# EAGLE design test_reg (EAGLE 9.6.2)
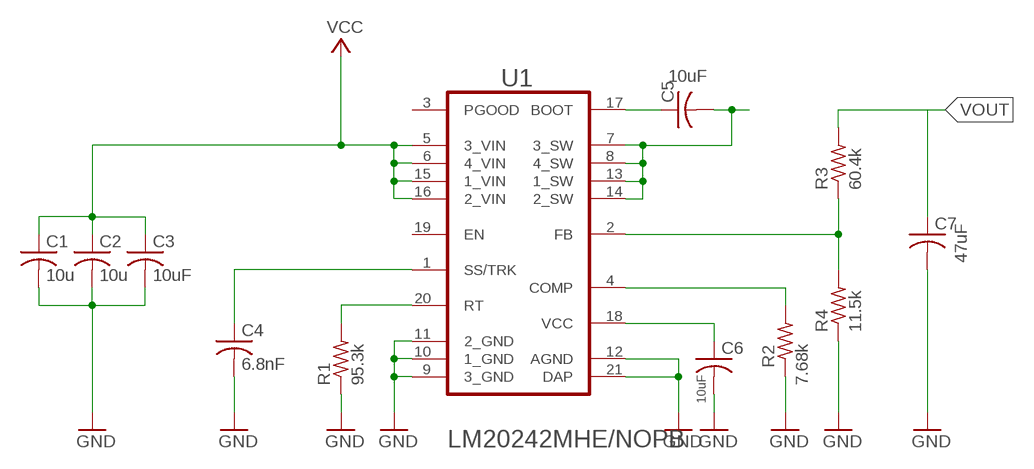
[diagram p0: schematic, sheet 1]

## Parts
C1  10u  C-USC0805  [C0805]
C2  10u  C-USC0805  [C0805]
C3  10uF  C-USC0805  [C0805]
C4  6.8nF  C-USC0805  [C0805]
C5  10uF  C-USC0805  [C0805]
C6  10uF  C-USC0805  [C0805]
C7  47uF  C-USC0805  [C0805]
R1  95.3k  R-US_R0805  [R0805]
R2  7.68k  R-US_R0805  [R0805]
R3  60.4k  R-US_R0805  [R0805]
R4  11.5k  R-US_R0805  [R0805]
U1  TI_NATIONAL_SEMICONDUCTOR_LM20242MHE-NOPBTI_NATIONAL_SEMICONDUCTOR_LM20242MHE-NOPB_0_0  [TI_NATIONAL_SEMICONDUCTOR_LM20242MHE-NOPB_0]

## Nets
GND: C1.2 C2.2 C3.2 C4.2 C6.2 C7.2 R1.1 R2.1 R4.1 U1.9(3_GND) U1.10(1_GND) U1.11(2_GND) U1.12(AGND) U1.21(DAP)
N$1: R1.2 U1.20(RT)
N$2: R2.2 U1.4(COMP)
N$3: C4.1 U1.1(SS/TRK)
N$4: C5.2 U1.7(3_SW) U1.8(4_SW) U1.13(1_SW) U1.14(2_SW)
N$5: C5.1 U1.17(BOOT)
N$6: R3.1 R4.2 U1.2(FB)
N$9: C6.1 U1.18(VCC)
VCC: C1.1 C2.1 C3.1 U1.5(3_VIN) U1.6(4_VIN) U1.15(1_VIN) U1.16(2_VIN)
VOUT: C7.1 R3.2
Unconnected: U1.3(PGOOD) U1.19(EN)

## Library data of the parts
C1-C7 = resistor:C-US: CAPACITOR, American symbol
R1-R4 = rcl:R-US_: RESISTOR, American symbol; SPICEPREFIX: R
U1 = NOPB:TI_NATIONAL_SEMICONDUCTOR_LM20242MHE-NOPB: PM-REG-LM20242; CIIVA_IDS: 1490726; CODE__JEDEC: MO-153-ACT; COMPONENT_LINK_1_DESCRIPTION: Datasheet URL; COMPONENT_LINK_1_URL: http://www.ti.com/general/docs/lit/getliterature.tsp?genericPartNumber=LM20242&fileType=pdf; COMP_TYPE: Switcher; FOOTPRINT_VARIANT_NAME_0: Level C; FOOTPRINT_VARIANT_NAME_1: Level B; FOOTPRINT_VARIANT_NAME_2: Level A; IMPORTED: yes; IMPORTED_FROM: vault; IMPORT_TS: 1521854401; MF: TI National Semiconductor; MPN: LM20242MHE/NOPB; PACKAGE: PWP0020A; PACKAGE_DESCRIPTION: Molded TSSOP, Jedec, 6.5 x 4.4 x 0.9mm Body, 20 Lead, 0.65mm Pitch, Exposed Pad; PACKAGE_TOP_MARKING: NSUZXYTT*20242*MH; PIN_COUNT: 20; POWER_WISE: Y; PREFIX: U; RELEASE_DATE: 1464081014; ROHS: Yes; VAULT_GUID: 3837F751-FFDA-45D0-A972-9457BC8C977B; VAULT_REVISION: DB6983F7-91C3-4F88-8B29-BB9202A2DCF1

## Board
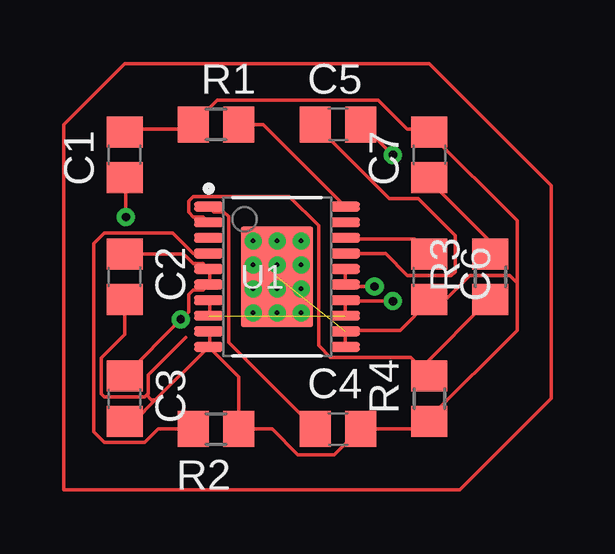
[diagram p1: board, top side]
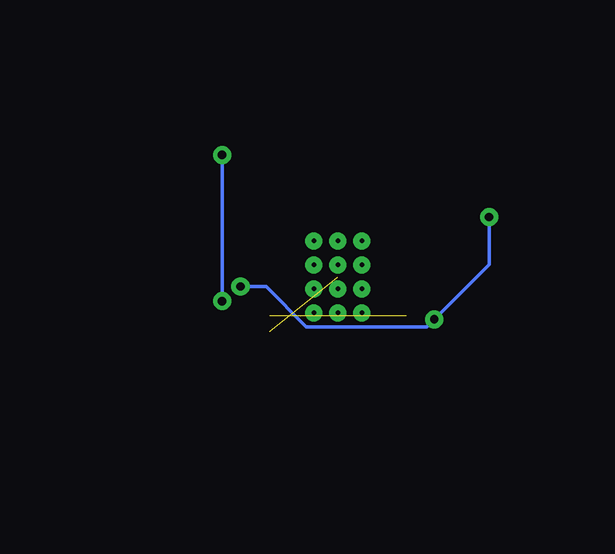
[diagram p2: board, bottom side, seen from below]

No outline drawn. Coordinates in mm, seen from the top.
Copper layers (1*16): Top 0.035mm / dielectric 1.5mm / Bottom 0.035mm
Design rules "default": minimum track width 6mil, minimum drill 0.35mm, track to track 6mil, track to pad 6mil, pad to pad 6mil, via to via 6mil, smd to smd 6mil, copper to edge 40mil, drill to drill 6mil, minimum pad ring 10mil, minimum via ring 8mil, stop-mask expansion 4mil, vias tented up to drill 0mil, thermal gap 10mil

### Footprints (pad centres in the part's own frame; a part is rotated, then mirrored left to right if it is on the bottom)
C0805 = smd 1.3 x 1.5: 1 -0.95,0; 2 0.95,0
R0805 = smd 1.3 x 1.5: 1 -0.95,0; 2 0.95,0
TI_NATIONAL_SEMICONDUCTOR_LM20242MHE-NOPB_0 = smd 1.2 x 0.4: 1 -2.85,2.925; 2 -2.85,2.275; 3 -2.85,1.625; 4 -2.85,0.975; 5 -2.85,0.325; 6 -2.85,-0.325; 7 -2.85,-0.975; 8 -2.85,-1.625; 9 -2.85,-2.275; 10 -2.85,-2.925; 11 2.85,-2.925; 12 2.85,-2.275; 13 2.85,-1.625; 14 2.85,-0.975; 15 2.85,-0.325; 16 2.85,0.325; 17 2.85,0.975; 18 2.85,1.625; 19 2.85,2.275; 20 2.85,2.925 | smd 3 x 4.2: 21 0,0 | drill 0.2 pad 0.5: PAD_1 0,1.5; PAD_2 1,1.5; PAD_3 -1,1.5; PAD_4 -1,0.5; PAD_5 -1,-0.5; PAD_6 -1,-1.5; PAD_7 1,-1.5; PAD_8 0,-1.5; PAD_9 1,-0.5; PAD_10 0,-0.5; PAD_11 1,0.5; PAD_12 0,0.5

### Placement (x,y rotation side)
C1  10.16,22.86 90 top
C2  10.16,17.78 270 top
C3  10.16,12.7 270 top
C4  19.05,11.43 0 top
C5  19.05,24.13 0 top
C6  22.86,17.78 270 top
C7  22.86,22.86 90 top
R1  13.97,24.13 0 top
R2  13.97,11.43 180 top
R3  25.4,17.78 90 top
R4  22.86,12.7 90 top
U1  16.51,17.78 0 top

### Tracks (layer width: path | path; a pad name or v marks a point on that pad's centre or on a via)
GND  (1 unrouted)
  Top 0.152: 11.08,12.85 11.01,12.77 9.31,12.77 9.18,12.9 9.18,14.39 10.16,15.37 C2.2 | 11.08,12.85 11.14,12.9 11.14,13.68 12.7,15.24 | C3.2 10.55,11.75 11.44,12.64 | 11.44,12.64 U1.10 | U1.10 14.92,13.6 R2.1 16.31,11.43 17.37,10.36 18.9,10.36 19.96,11.43 C4.2 22.55,11.43 22.86,11.73 R4.1 22.86,11.89 26.52,15.54 26.52,17.53 | C1.2 10.21,23.93 12.8,23.93 12.95,24.08 R1.1 13.11,24.23 14.02,25.15 20.73,25.15 21.95,23.93 22.86,23.93 C7.2 22.86,23.77 26.52,20.12 26.52,17.53 | U1.11 19.36,14.94 19.36,15.39 U1.12 19.51,15.54 21.64,15.54 22.86,16.76 C6.2 22.86,16.92 23.62,16.92 24.54,17.83 26.21,17.83 26.52,17.53 | U1.9 13.72,15.39 13.72,14.94 U1.10 | 11.08,12.85 11.28,12.65 11.43,12.65 11.44,12.64
N$1
  Top 0.152: R1.2 15.94,24.13 U1.20
N$2
  Top 0.152: R2.2 11.56,11.43 11.01,10.87 9.31,10.87 8.88,11.31 8.88,19.17 9.31,19.61 12.17,19.61 13.03,18.75 U1.4
N$3
  Top 0.152: C4.1 14.49,15.04 14.49,20.29 14.3,20.48 13.88,20.48 U1.1
N$4  (via drill 0.35)  (1 unrouted)
  Top 0.152: U1.13 19.36,16.31 19.36,16.76 U1.14 19.51,16.76 v21.34,16.76 | v21.34,22.86 20.12,24.08 C5.2 | U1.8 13.72,16.31 13.72,16.76 U1.7
  Bottom 0.152: v21.34,22.86 v21.34,16.76
N$5
  Top 0.152: U1.17 19.51,18.75 21.03,18.75 21.95,17.83 23.77,17.83 23.93,17.98 23.93,19.51 22.4,21.03 21.18,21.03 18.14,24.08 C5.1
N$6
  Top 0.152: U1.2 13.44,20.28 13.02,20.28 12.83,20.47 12.83,20.94 13.02,21.13 17.03,21.13 18.24,19.92 18.24,14.91 18.72,14.43 22.08,14.43 R4.2 22.55,14.02 25.3,16.76 R3.1
N$7
  Top 0.152: 7.62,8.89 7.62,24.13 10.16,26.67 22.86,26.67 27.94,21.59 27.94,12.7 24.13,8.89 7.62,8.89
N$9
  Top 0.152: U1.18 19.51,19.36 22.25,19.36 22.86,18.75 C6.1
VCC  (via drill 0.35)
  Top 0.152: C2.1 12.62,18.73 13.02,18.33 13.44,18.33 U1.5 13.72,17.98 13.72,17.53 U1.6 13.44,17.23 13.02,17.23 12.83,17.04 12.83,16.32 v12.5,15.99 | C3.1 v12.5,15.99 | U1.16 19.36,17.98 19.36,17.53 U1.15 19.51,17.37 v20.57,17.37 | v12.5,16 v12.5,15.99 | v10.21,20.27 10.21,21.79 C1.1
  Bottom 0.152: v20.57,17.37 19.51,17.37 17.83,15.7 12.8,15.7 v12.5,16 10.21,18.29 v10.21,20.27
VOUT
  Top 0.152: R3.2 25.3,18.75 25.3,19.36 22.86,21.79 C7.1